# Altium schematic sheet AudioDSP-v2.0_top.SchDoc
size A3; SheetNumber: 1; SheetTotal: 13
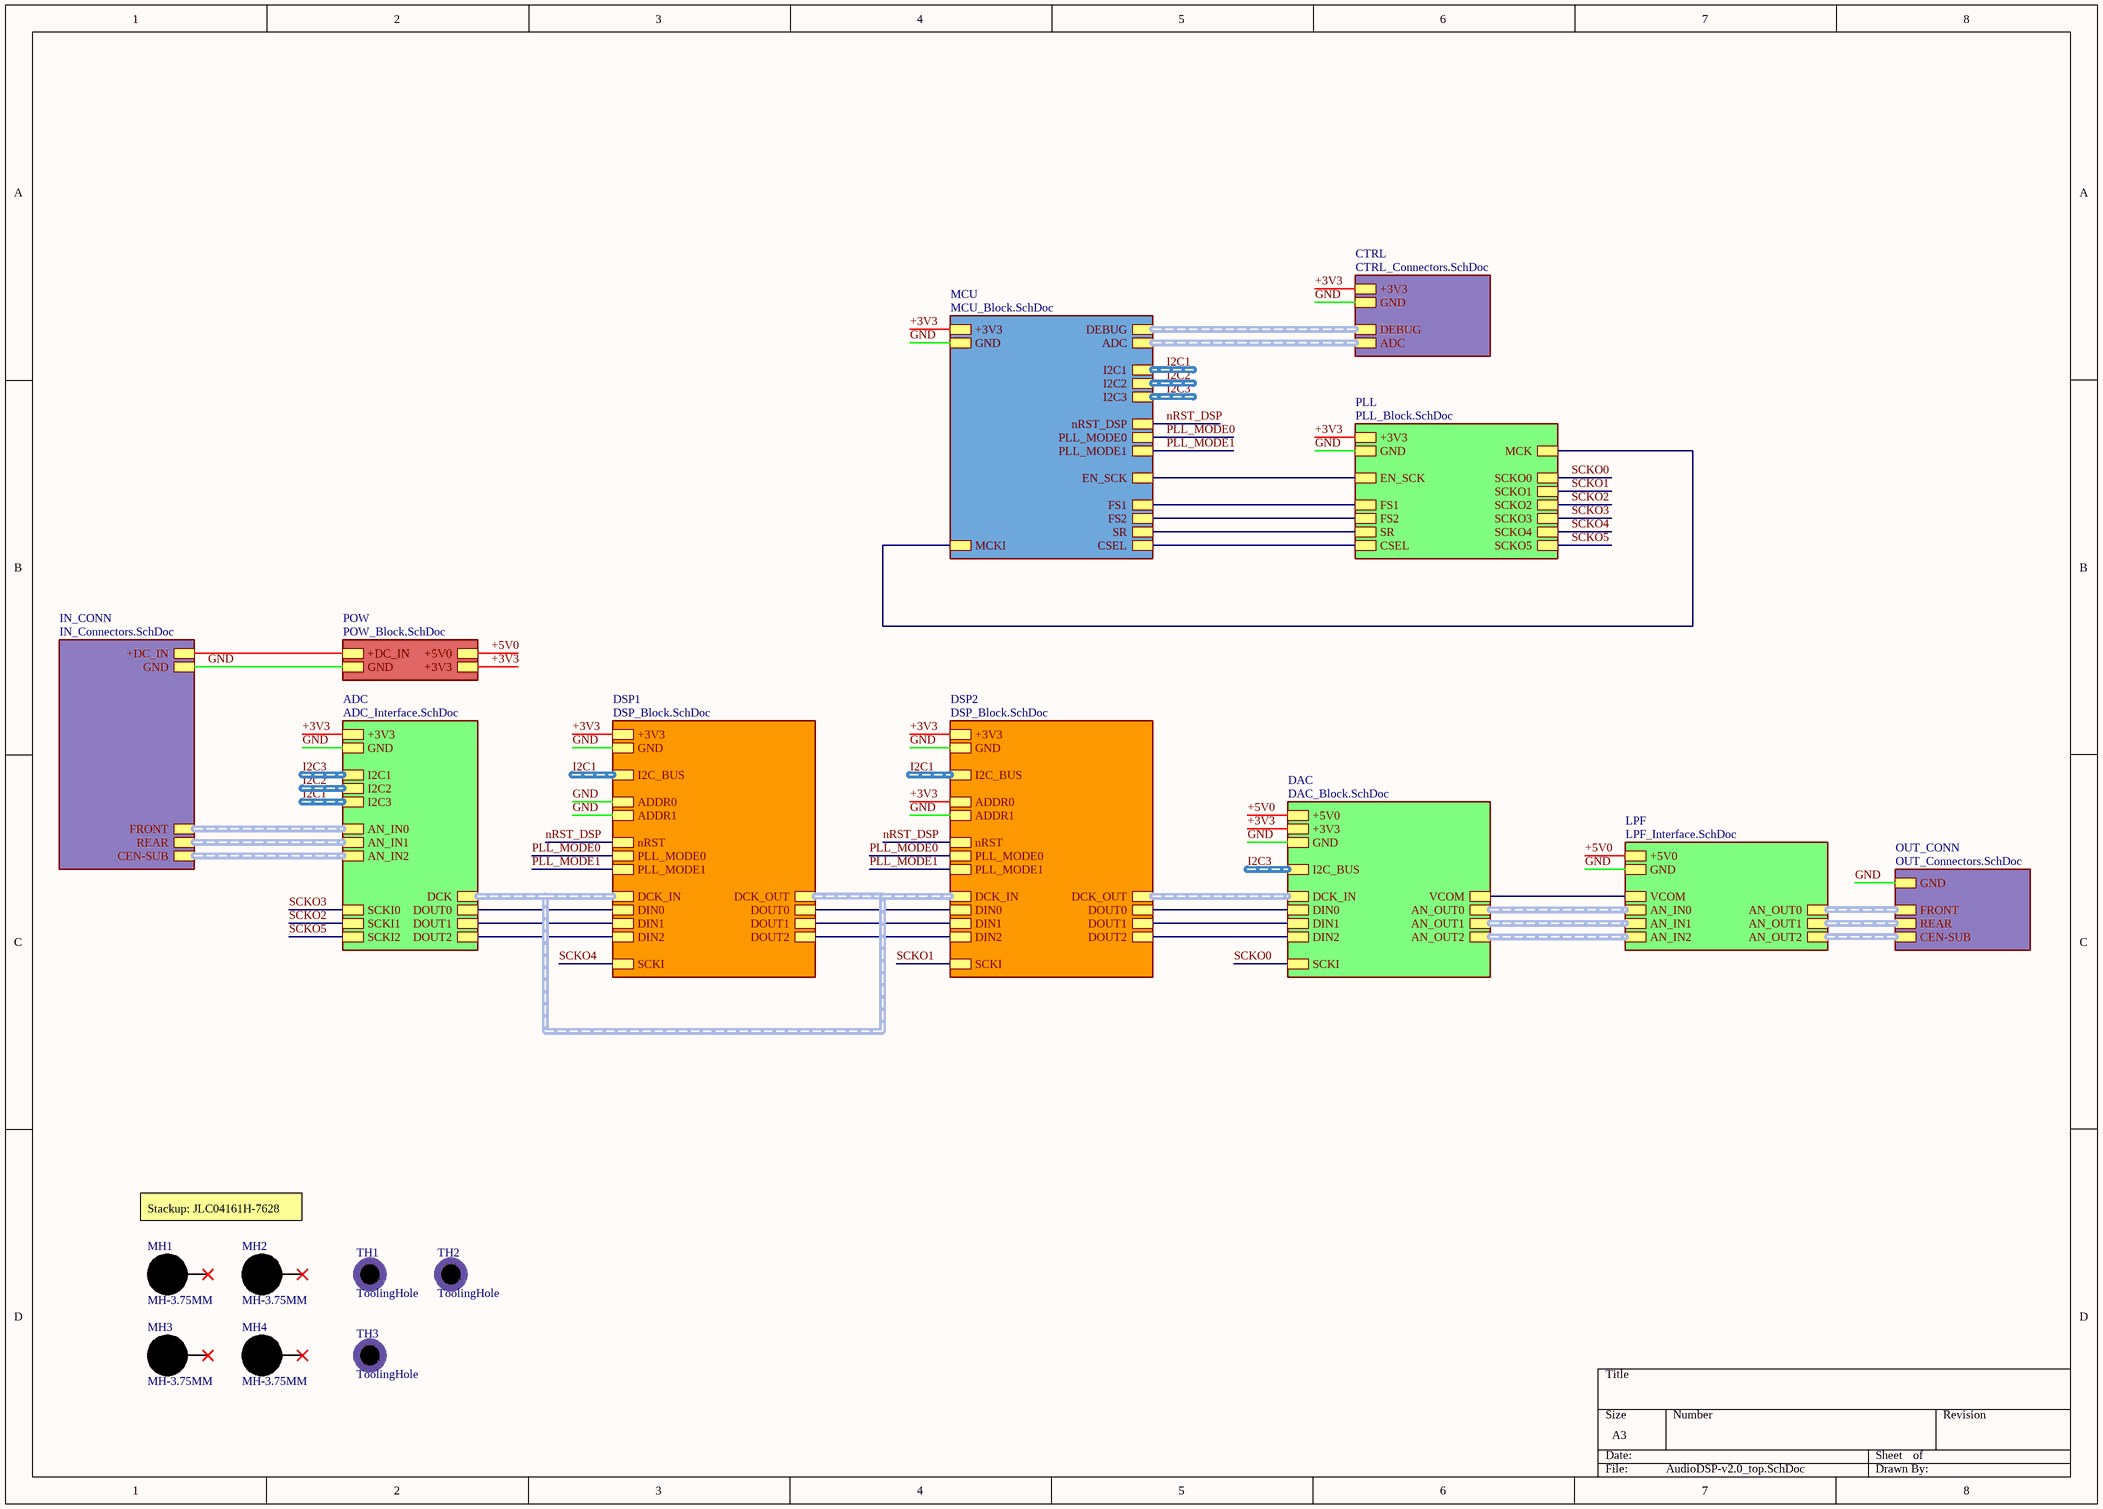
[diagram p0: AudioDSP-v2.0_top.SchDoc]

## Parts
MH1  MH-3.75MM  [MH-3.75mm-NP]  (no BOM)
MH2  MH-3.75MM  [MH-3.75mm-NP]  (no BOM)
MH3  MH-3.75MM  [MH-3.75mm-NP]  (no BOM)
MH4  MH-3.75MM  [MH-3.75mm-NP]  (no BOM)
TH1  ToolingHole  [TOOLING-HOLE]  (no BOM)
TH2  ToolingHole  [TOOLING-HOLE]  (no BOM)
TH3  ToolingHole  [TOOLING-HOLE]  (no BOM)

## Sub-sheets
ADC = ADC_Interface.SchDoc: +3V3, GND, I2C1 (harness I2C), AN_IN1 (harness AN), SCKI0, I2C2 (harness I2C), I2C3 (harness I2C), SCKI2, SCKI1, AN_IN2 (harness AN), AN_IN0 (harness AN), DCK (harness DCK), DOUT0, DOUT1, DOUT2
CTRL = CTRL_Connectors.SchDoc: DEBUG (harness SW), +3V3, GND, ADC (harness ADC)
DAC = DAC_Block.SchDoc: +3V3, GND, I2C_BUS (harness I2C), +5V0, VCOM, DIN0, DIN1, DIN2, DCK_IN (harness DCK), SCKI, AN_OUT0 (harness AN), AN_OUT1 (harness AN), AN_OUT2 (harness AN)
DSP1 = DSP_Block.SchDoc: +3V3, GND, PLL_MODE0, PLL_MODE1, SCKI, nRST, ADDR0, ADDR1, I2C_BUS (harness I2C), DCK_IN (harness DCK), DIN0, DIN1, DIN2, DCK_OUT (harness DCK), DOUT0, DOUT1, DOUT2
DSP2 = DSP_Block.SchDoc: +3V3, GND, PLL_MODE0, PLL_MODE1, SCKI, nRST, ADDR0, ADDR1, I2C_BUS (harness I2C), DCK_IN (harness DCK), DIN0, DIN1, DIN2, DCK_OUT (harness DCK), DOUT0, DOUT1, DOUT2
IN_CONN = IN_Connectors.SchDoc: +DC_IN, GND, FRONT (harness AN), REAR (harness AN), CEN-SUB (harness AN)
LPF = LPF_Interface.SchDoc: +5V0, GND, VCOM, AN_IN0 (harness AN), AN_IN1 (harness AN), AN_IN2 (harness AN), AN_OUT0 (harness AN), AN_OUT1 (harness AN), AN_OUT2 (harness AN)
MCU = MCU_Block.SchDoc: +3V3, GND, DEBUG (harness SW), ADC (harness ADC), I2C1 (harness I2C), I2C2 (harness I2C), I2C3 (harness I2C), MCKI, nRST_DSP, PLL_MODE0, PLL_MODE1, EN_SCK, FS1, FS2, SR, CSEL
OUT_CONN = OUT_Connectors.SchDoc: FRONT (harness AN), REAR (harness AN), CEN-SUB (harness AN), GND
PLL = PLL_Block.SchDoc: +3V3, GND, FS1, FS2, SR, CSEL, MCK, EN_SCK, SCKO0, SCKO1, SCKO2, SCKO3, SCKO4, SCKO5
POW = POW_Block.SchDoc: +DC_IN, GND, +5V0, +3V3

## Nets
+3V3: sheet PLL/+3V3, sheet DSP1/+3V3, sheet DSP2/+3V3, sheet DSP2/ADDR0, sheet DAC/+3V3, sheet POW/+3V3, sheet MCU/+3V3, sheet CTRL/+3V3, sheet ADC/+3V3
+5V0: sheet DAC/+5V0, sheet POW/+5V0, sheet LPF/+5V0
GND: sheet PLL/GND, sheet DSP1/GND, sheet DSP1/ADDR0, sheet DSP1/ADDR1, sheet DSP2/GND, sheet DSP2/ADDR1, sheet DAC/GND, sheet POW/GND, sheet IN_CONN/GND, sheet OUT_CONN/GND, sheet MCU/GND, sheet CTRL/GND, sheet ADC/GND, sheet LPF/GND
nRST_DSP: sheet DSP1/nRST, sheet DSP2/nRST, sheet MCU/nRST_DSP
PLL_MODE0: sheet DSP1/PLL_MODE0, sheet DSP2/PLL_MODE0, sheet MCU/PLL_MODE0
PLL_MODE1: sheet DSP1/PLL_MODE1, sheet DSP2/PLL_MODE1, sheet MCU/PLL_MODE1
SCKO0: sheet PLL/SCKO0, sheet DAC/SCKI
SCKO1: sheet PLL/SCKO1, sheet DSP2/SCKI
SCKO2: sheet PLL/SCKO2, sheet ADC/SCKI1
SCKO3: sheet PLL/SCKO3, sheet ADC/SCKI0
SCKO4: sheet PLL/SCKO4, sheet DSP1/SCKI
SCKO5: sheet PLL/SCKO5, sheet ADC/SCKI2
(unnamed): sheet PLL/FS1, sheet MCU/FS1
(unnamed): sheet PLL/FS2, sheet MCU/FS2
(unnamed): sheet PLL/SR, sheet MCU/SR
(unnamed): sheet PLL/CSEL, sheet MCU/CSEL
(unnamed): sheet PLL/MCK, sheet MCU/MCKI
(unnamed): sheet PLL/EN_SCK, sheet MCU/EN_SCK
(unnamed): sheet DSP1/DIN0, sheet ADC/DOUT0
(unnamed): sheet DSP1/DIN1, sheet ADC/DOUT1
(unnamed): sheet DSP1/DIN2, sheet ADC/DOUT2
(unnamed): sheet DSP1/DOUT0, sheet DSP2/DIN0
(unnamed): sheet DSP1/DOUT1, sheet DSP2/DIN1
(unnamed): sheet DSP1/DOUT2, sheet DSP2/DIN2
(unnamed): sheet DSP2/DOUT0, sheet DAC/DIN0
(unnamed): sheet DSP2/DOUT1, sheet DAC/DIN1
(unnamed): sheet DSP2/DOUT2, sheet DAC/DIN2
(unnamed): sheet DAC/VCOM, sheet LPF/VCOM
(unnamed): sheet POW/+DC_IN, sheet IN_CONN/+DC_IN

Not connected (* = marked no-connect by the designer): MH1 1*; MH2 1*; MH3 1*; MH4 1*

## Buses and harness runs
harness I2C1 = sheet ADC/I2C3
harness I2C1 = sheet DSP1/I2C_BUS
harness I2C1 = sheet DSP2/I2C_BUS
harness I2C1 = sheet MCU/I2C1
harness I2C2 = sheet ADC/I2C2
harness I2C2 = sheet MCU/I2C2
harness I2C3 = sheet ADC/I2C1
harness I2C3 = sheet DAC/I2C_BUS
harness I2C3 = sheet MCU/I2C3
harness sheet ADC/AN_IN0 = sheet IN_CONN/FRONT
harness sheet ADC/AN_IN1 = sheet IN_CONN/REAR
harness sheet ADC/AN_IN2 = sheet IN_CONN/CEN-SUB
harness sheet ADC/DCK = sheet DSP1/DCK_IN = sheet DSP1/DCK_OUT = sheet DSP2/DCK_IN
harness sheet CTRL/ADC = sheet MCU/ADC
harness sheet CTRL/DEBUG = sheet MCU/DEBUG
harness sheet DAC/AN_OUT0 = sheet LPF/AN_IN0
harness sheet DAC/AN_OUT1 = sheet LPF/AN_IN1
harness sheet DAC/AN_OUT2 = sheet LPF/AN_IN2
harness sheet DAC/DCK_IN = sheet DSP2/DCK_OUT
harness sheet LPF/AN_OUT0 = sheet OUT_CONN/FRONT
harness sheet LPF/AN_OUT1 = sheet OUT_CONN/REAR
harness sheet LPF/AN_OUT2 = sheet OUT_CONN/CEN-SUB

## Notes on the sheet
- Stackup: JLC04161H-7628

## Library data of the parts
MH1-MH4 = MH-3.75MM: ClassName: MountHole
TH1-TH3 = ToolingHole: ClassName: Tooling